# EAGLE design HONDA_BCAN (EAGLE 9.6.2)
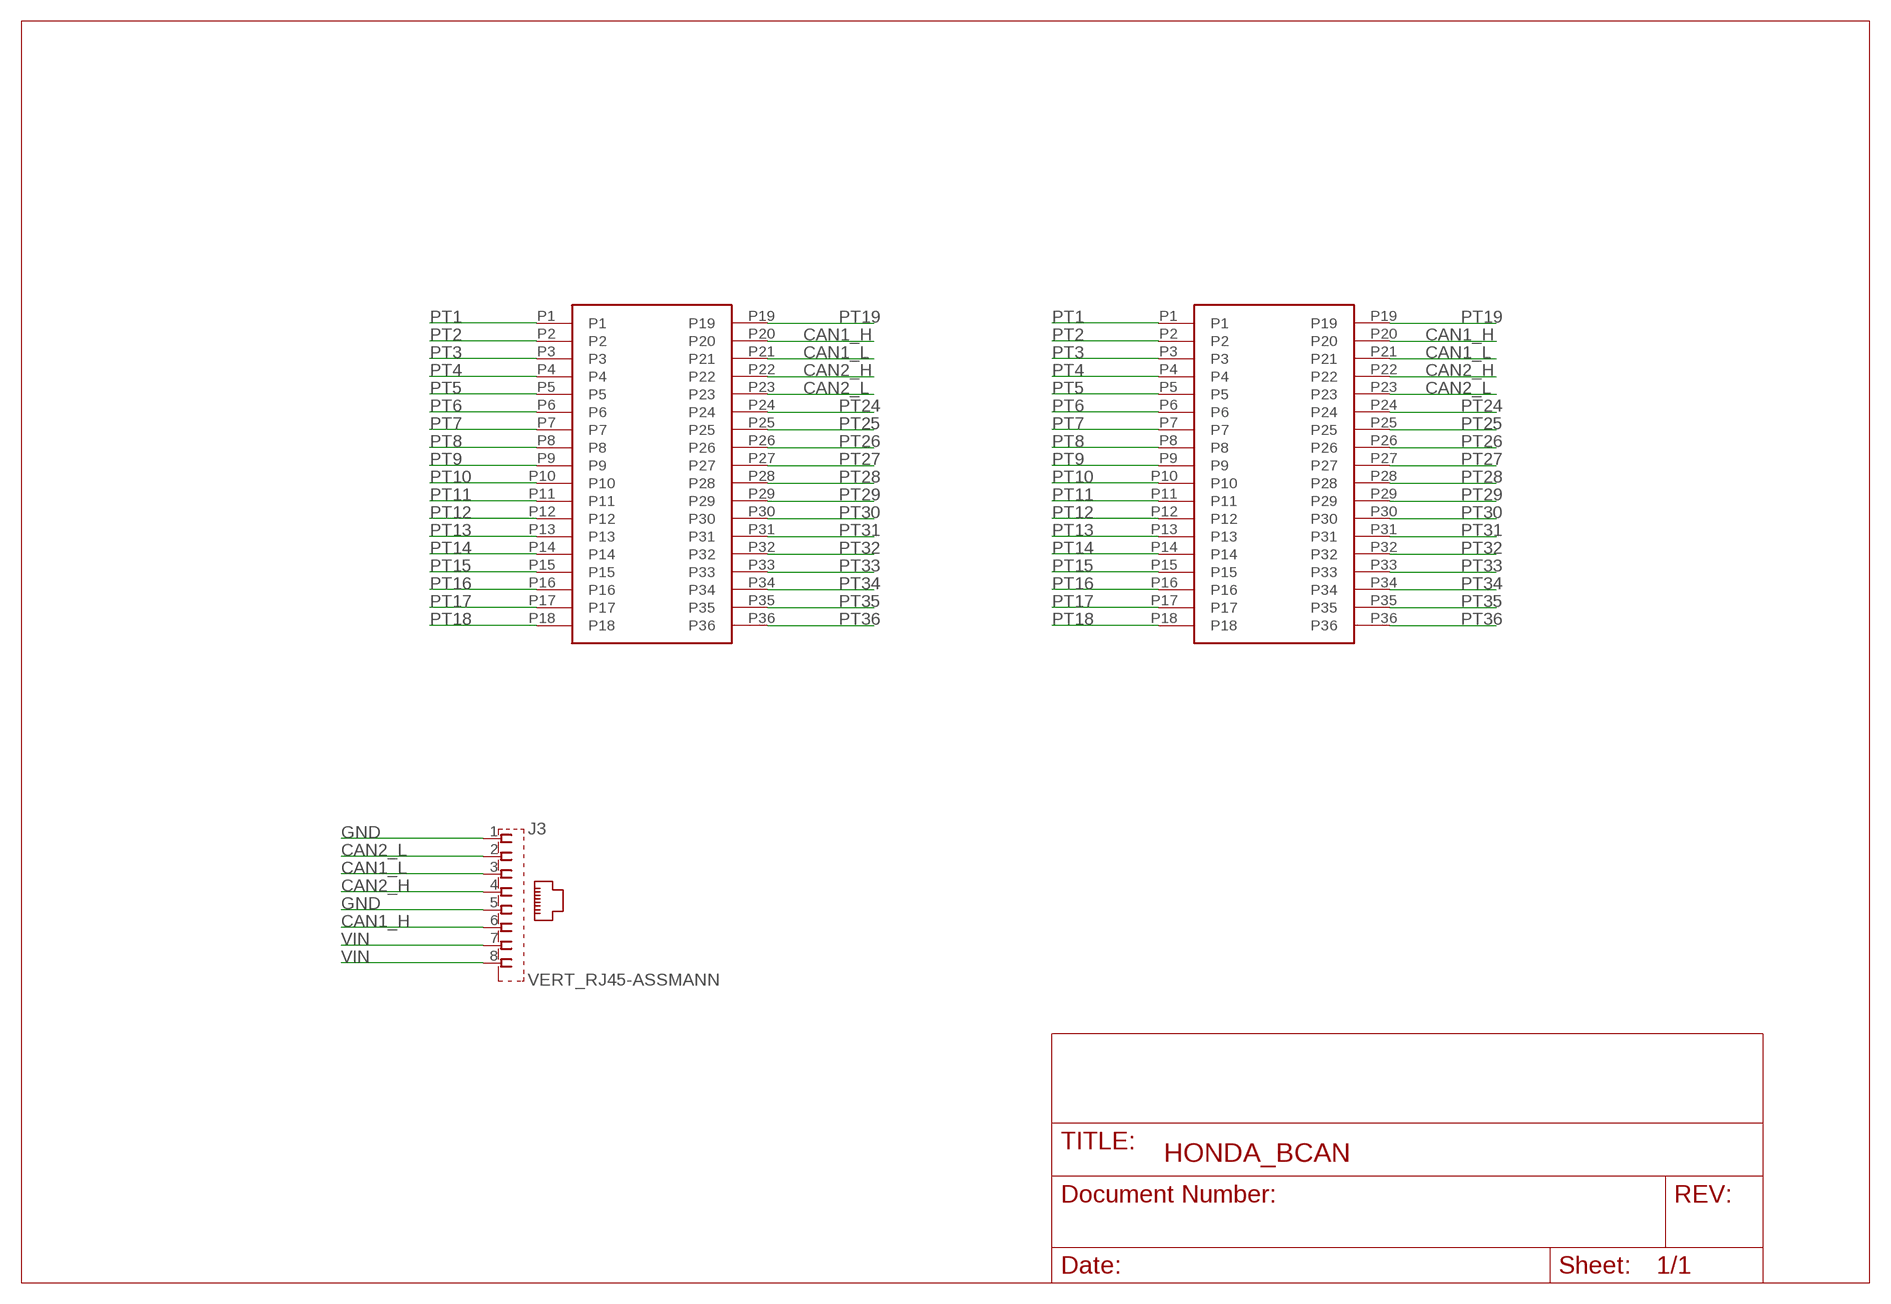
[diagram p0: schematic, sheet 1]

## Parts
J1  MX34036NF4  [MX34036NF4]
J2  MX34036NF4  [MX34036NF4]
J3  VERT_RJ45-ASSMANN  [RJ45-VERT]

## Nets
CAN1_H: J1.P20 J2.P20 J3.6
CAN1_L: J1.P21 J2.P21 J3.3
CAN2_H: J1.P22 J2.P22 J3.4
CAN2_L: J1.P23 J2.P23 J3.2
GND: J3.1 J3.5
PT1: J1.P1 J2.P1
PT2: J1.P2 J2.P2
PT3: J1.P3 J2.P3
PT4: J1.P4 J2.P4
PT5: J1.P5 J2.P5
PT6: J1.P6 J2.P6
PT7: J1.P7 J2.P7
PT8: J1.P8 J2.P8
PT9: J1.P9 J2.P9
PT10: J1.P10 J2.P10
PT11: J1.P11 J2.P11
PT12: J1.P12 J2.P12
PT13: J1.P13 J2.P13
PT14: J1.P14 J2.P14
PT15: J1.P15 J2.P15
PT16: J1.P16 J2.P16
PT17: J1.P17 J2.P17
PT18: J1.P18 J2.P18
PT19: J1.P19 J2.P19
PT24: J1.P24 J2.P24
PT25: J1.P25 J2.P25
PT26: J1.P26 J2.P26
PT27: J1.P27 J2.P27
PT28: J1.P28 J2.P28
PT29: J1.P29 J2.P29
PT30: J1.P30 J2.P30
PT31: J1.P31 J2.P31
PT32: J1.P32 J2.P32
PT33: J1.P33 J2.P33
PT34: J1.P34 J2.P34
PT35: J1.P35 J2.P35
PT36: J1.P36 J2.P36
VIN: J3.7 J3.8

## Library data of the parts
J1 J2 = comma.ai:MX34036NF4; MPN: MX34036NF4
J3 = comma.ai:VERT_RJ45: Mod. Jack, Right Angle, 8 posiotion, 8 contatcs RJ45 Source: GLX-S-88M.pdf; MPN: A-2004-2-4-LPS-N-R

## Board
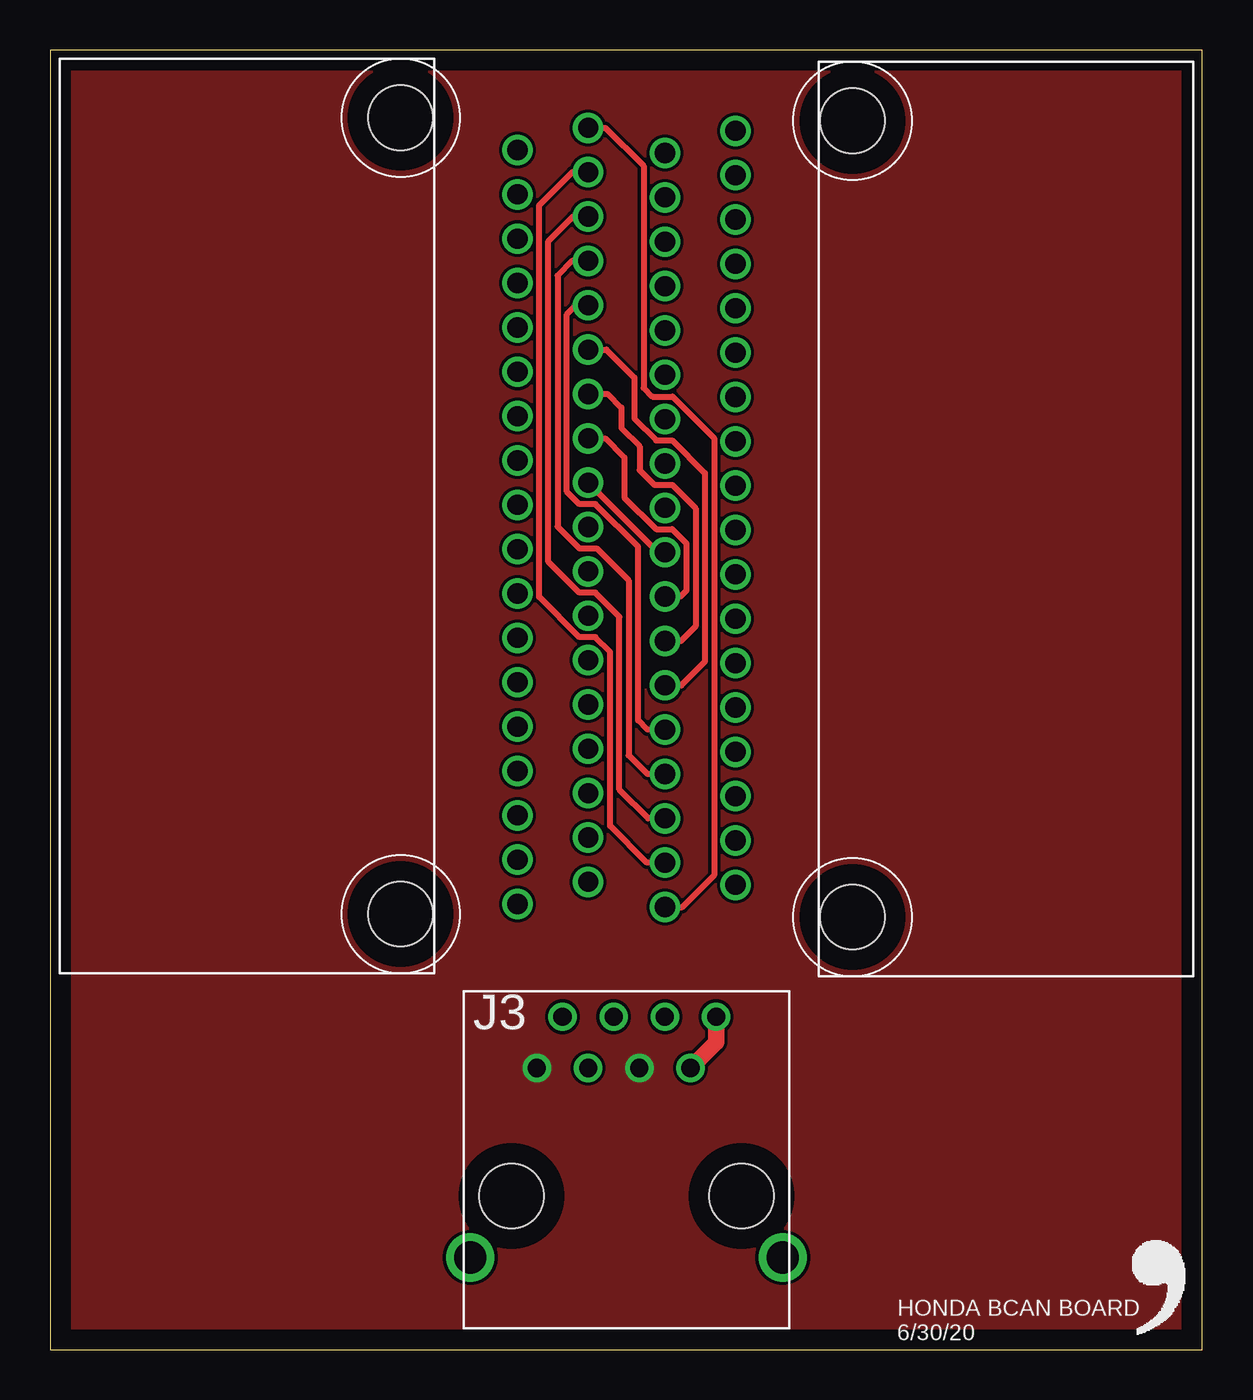
[diagram p1: board, top side]
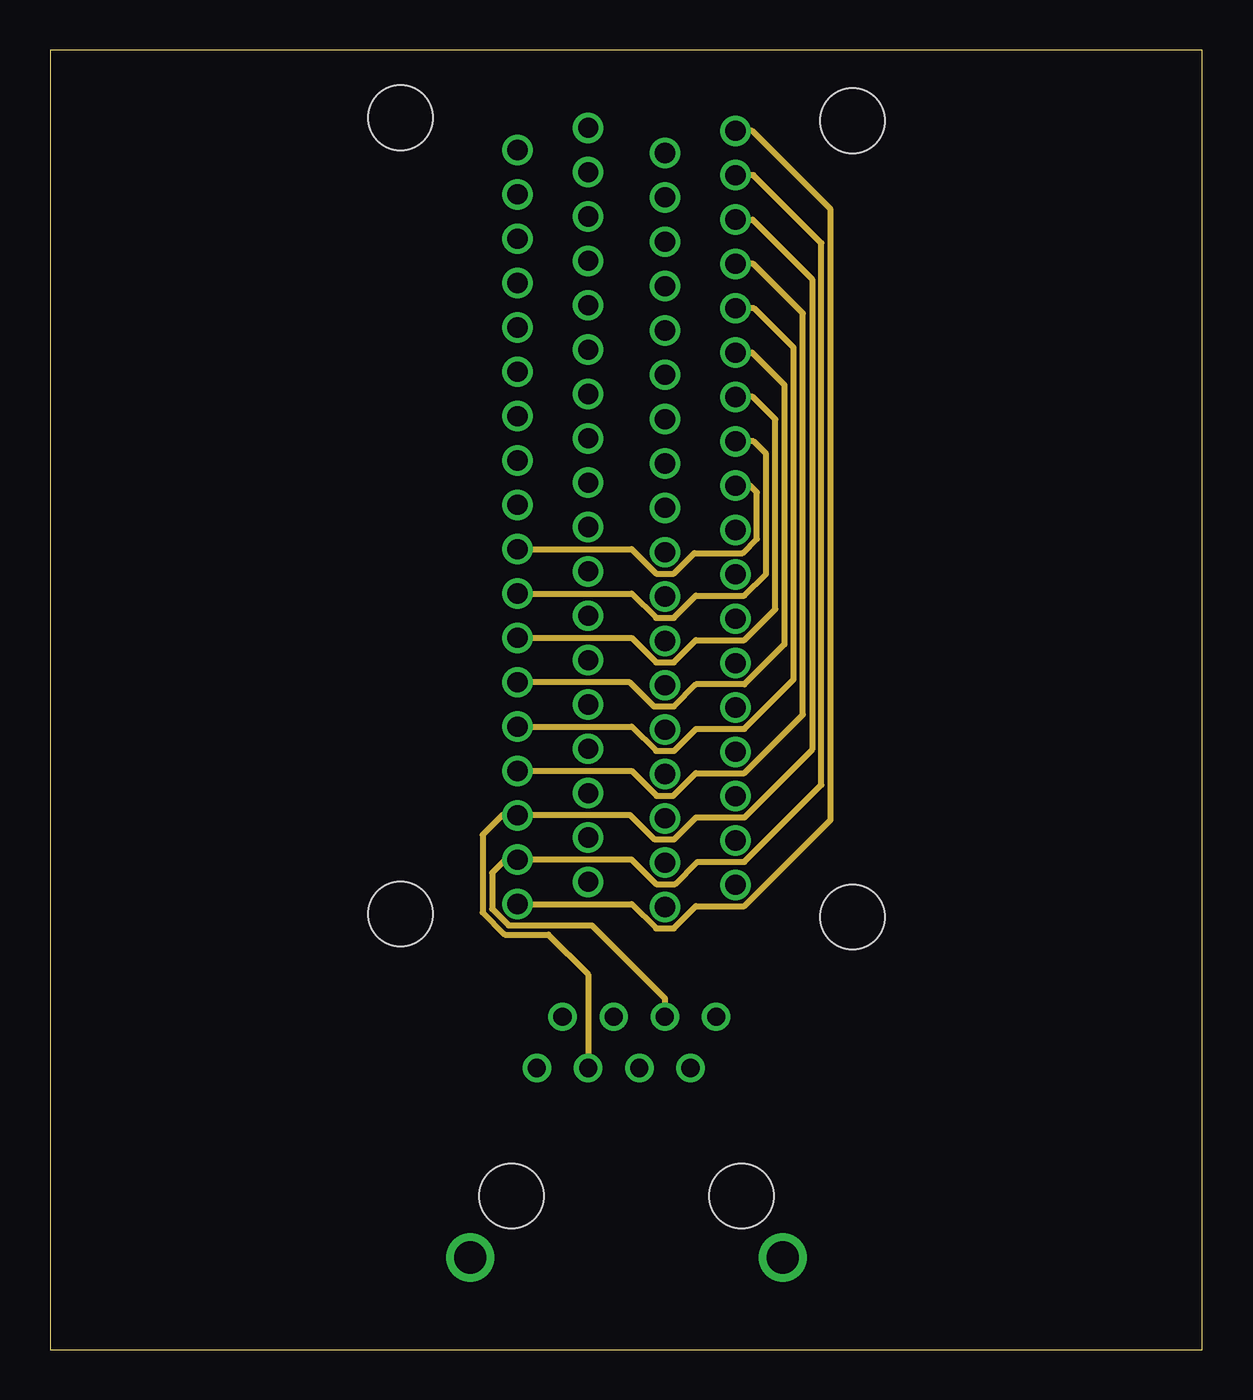
[diagram p2: board, inner layer Route2]
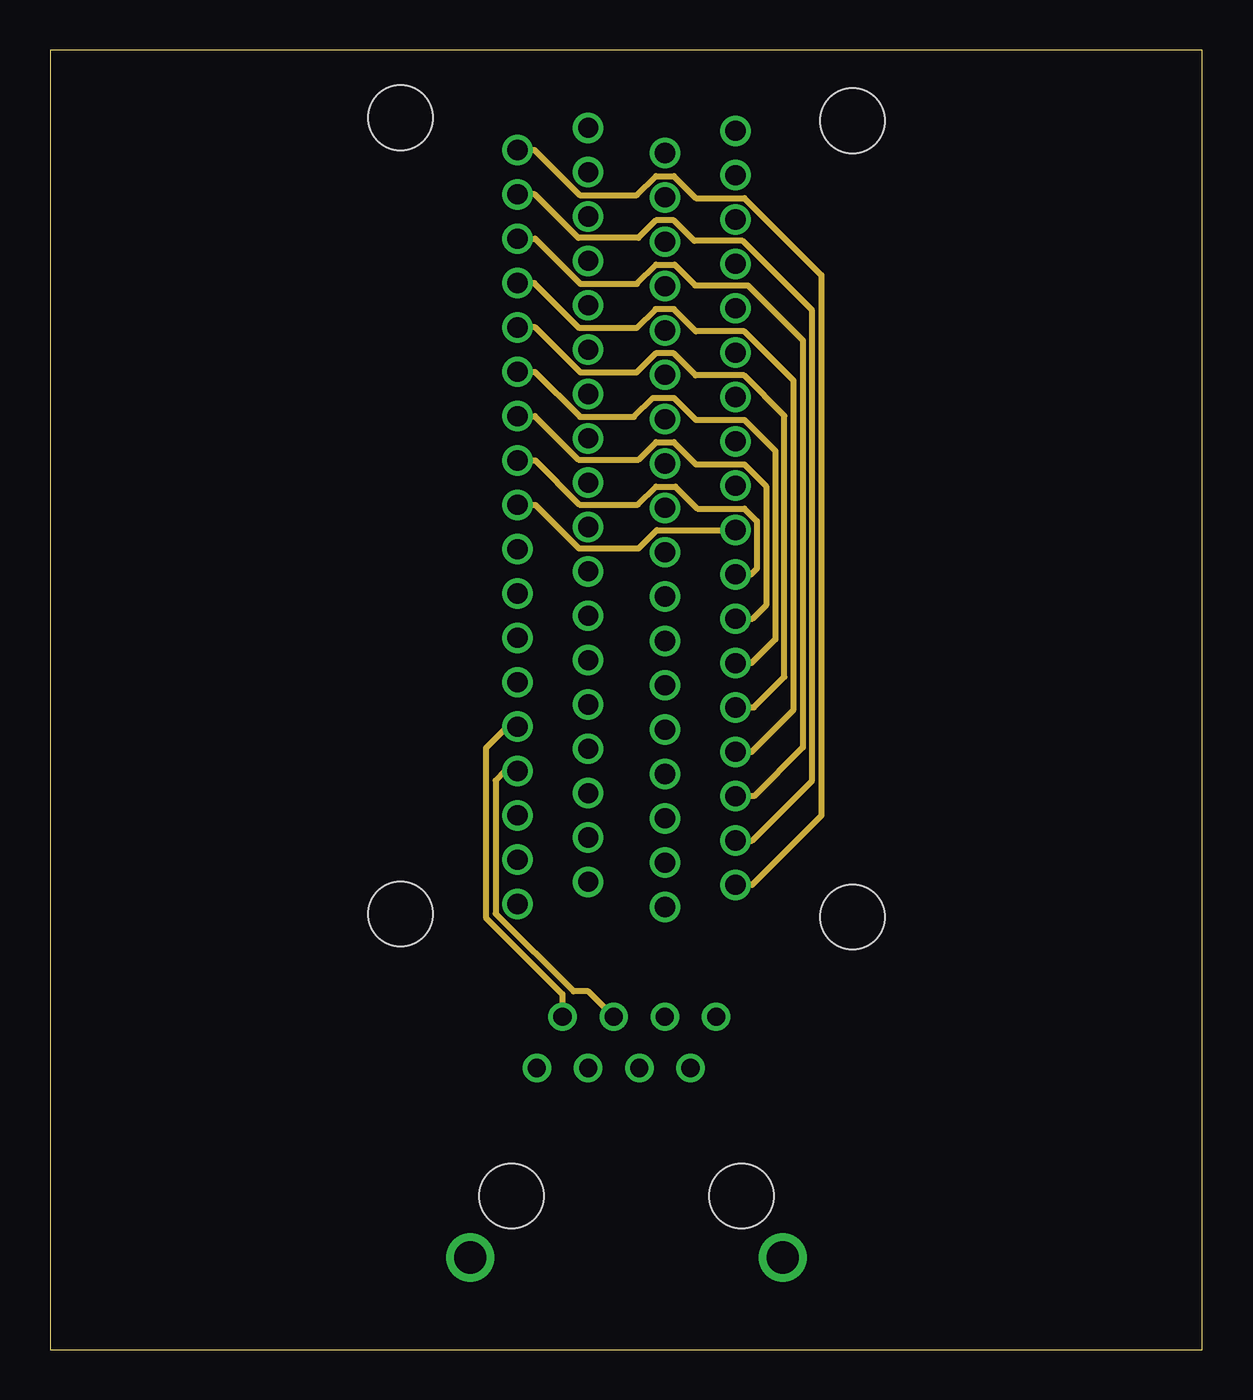
[diagram p3: board, inner layer Route15]
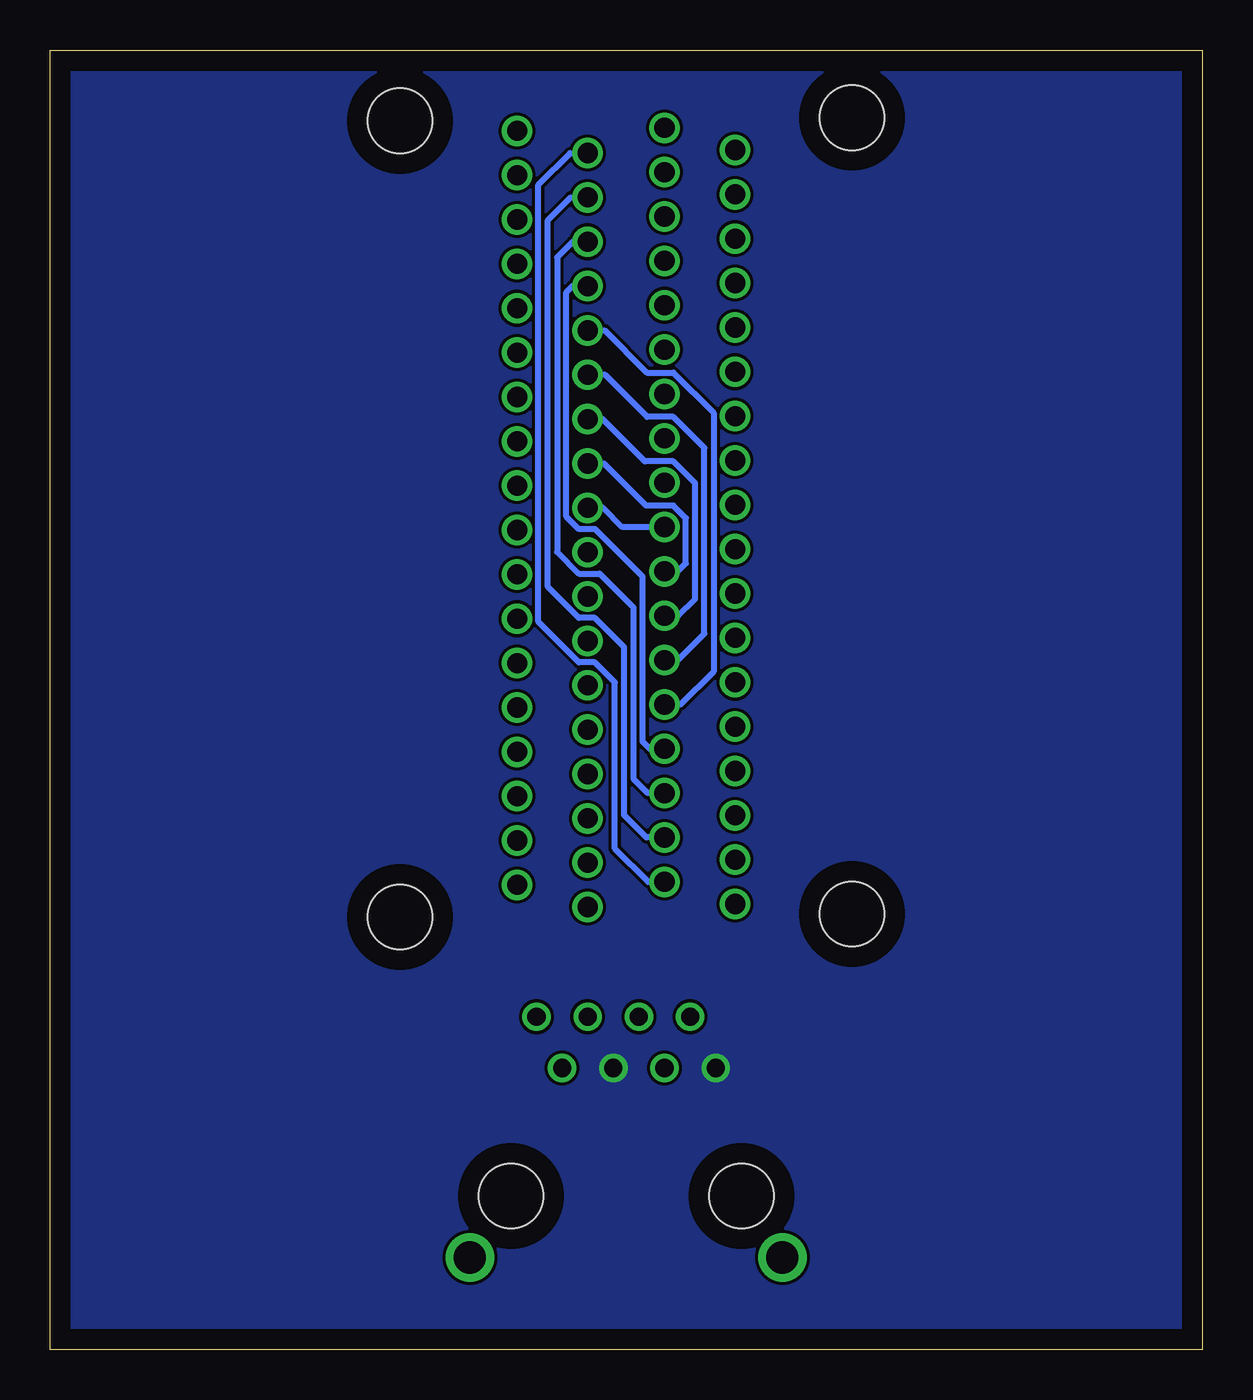
[diagram p4: board, bottom side, seen from below]

Size 57.13 x 64.44 mm. Coordinates in mm from the lower left corner, seen from the top.
Outline: 0,0 57.13,0 57.13,64.44 0,64.44 0,0
Copper layers (1+2*15+16): Top 0.035mm / dielectric 1.5mm / Route2 0.035mm / dielectric 0.15mm / Route15 0.035mm / dielectric 0.2mm / Bottom 0.035mm
Design rules "default *": minimum track width 6mil, minimum drill 0.35mm, track to track 6mil, track to pad 6mil, pad to pad 6mil, via to via 6mil, smd to smd 6mil, copper to edge 40mil, drill to drill 6mil, minimum pad ring 10mil, minimum via ring 8mil, stop-mask expansion 4mil, vias tented up to drill 0mil, thermal gap 10mil

### Footprints (pad centres in the part's own frame; a part is rotated, then mirrored left to right if it is on the bottom)
MX34036NF4 = drill 1: P1 19.98,2.54; P2 17.78,2.54; P3 15.58,2.54; P4 13.38,2.54; P5 11.18,2.54; P6 8.98,2.54; P7 6.78,2.54; P8 4.58,2.54; P9 2.38,2.54; P10 0.18,2.54; P11 -2.02,2.54; P12 -4.22,2.54; P13 -6.42,2.54; P14 -8.62,2.54; P15 -10.82,2.54; P16 -13.02,2.54; P17 -15.22,2.54; P18 -17.42,2.54; P19 21.08,-0.96; P20 18.88,-0.96; P21 16.68,-0.96; P22 14.48,-0.96; P23 12.28,-0.96; P24 10.08,-0.96; P25 7.88,-0.96; P26 5.68,-0.96; P27 3.48,-0.96; P28 1.28,-0.96; P29 -0.92,-0.96; P30 -3.12,-0.96; P31 -5.32,-0.96; P32 -7.52,-0.96; P33 -9.72,-0.96; P34 -11.92,-0.96; P35 -14.12,-0.96; P36 -16.32,-0.96 | hole 3.2: -17.92,-6.76; 21.58,-6.76
RJ45-VERT = drill 0.9: 1 -4.445,6.35; 2 -3.175,8.89; 3 -1.905,6.35; 4 -0.635,8.89; 5 0.635,6.35; 6 1.905,8.89; 7 3.175,6.35; 8 4.445,8.89 | drill 1.6: P$1 -7.75,-3.05; P$2 7.75,-3.05 | hole 3.2: -5.715,0; 5.715,0

### Placement (x,y rotation side)
J1  24.13,43.18 270 top
J2  33.02,39.37 90 top
J3  28.57,7.62 0 top
U$1  [LOGO]  53,0.44 0 top

### Tracks (layer width: path | path; a pad name or v marks a point on that pad's centre or on a via)
CAN1_H
  Route2 0.305: J2.P20 34.87,58.25 38.24,54.88 38.24,28.01 34.42,24.19 32.08,24.19 30.98,23.09 30.04,23.09 28.82,24.31 J1.P20 22.56,24.3 21.91,23.65 21.91,21.86 22.73,21.04 26.86,21.04 30.48,17.42 J3.6
CAN1_L
  Route2 0.305: J2.P21 34.83,56.05 37.78,53.1 37.78,29.75 34.42,26.39 32.02,26.39 30.92,25.29 29.98,25.29 28.76,26.51 J1.P21 22.42,26.51 21.44,25.53 21.44,21.68 22.55,20.58 24.7,20.58 26.67,18.61 J3.3
CAN2_H
  Route2 0.305: J1.P22 28.83,28.7 30.07,27.46 30.89,27.46 32.02,28.59 34.42,28.59 37.33,31.5 37.33,51.39 34.87,53.85 J2.P22
  Route15 0.305: J1.P22 22.57,28.7 22.09,28.22 22.09,21.63 25.95,17.77 26.68,17.77 J3.4
CAN2_L
  Route2 0.305: J1.P23 28.83,30.9 30.04,29.69 30.93,29.69 32.03,30.79 34.42,30.79 36.87,33.24 36.87,49.69 34.91,51.65 J2.P23
  Route15 0.305: J1.P23 22.66,30.9 21.6,29.84 21.6,21.43 25.4,17.63 J3.2
GND
  pour Top (no thermals): -1.27,66.04 -1.27,-2.54 59.69,-2.54 59.69,66.04
  pour Bottom (no thermals): -2.54,67.31 -2.54,-1.27 58.42,-1.27 58.42,67.31
PT1
  Bottom 0.305: J1.P1 27.48,23.2 29.13,24.85 29.13,33.1 30.12,34.09 30.92,34.09 32.92,36.09 32.92,57.78 31.35,59.35 J2.P1
PT2
  Bottom 0.305: J1.P2 27.57,25.4 28.67,26.5 28.67,34.84 30.12,36.29 30.92,36.29 32.45,37.83 32.45,56.02 31.32,57.15 J2.P2
PT3
  Bottom 0.305: J2.P3 31.22,54.95 32,54.17 32,39.57 30.92,38.49 29.89,38.49 28.22,36.82 28.22,28.32 27.5,27.6 J1.P3
PT4
  Bottom 0.305: J1.P4 27.4,29.8 27.76,30.16 27.76,38.33 30.12,40.69 30.92,40.69 31.54,41.31 31.54,52.45 31.24,52.75 J2.P4
PT5
  Bottom 0.305: J2.P5 29.64,50.55 27.55,48.46 26.23,48.46 24.24,46.47 24.24,33.63 25.87,32 J1.P5
PT6
  Bottom 0.305: J1.P6 26.01,34.2 24.7,35.52 24.7,44.72 26.23,46.26 27.53,46.26 29.62,48.35 J2.P6
PT7
  Bottom 0.305: J2.P7 29.74,46.15 27.65,44.06 26.23,44.06 25.15,42.98 25.15,37.23 25.98,36.4 J1.P7
PT8
  Bottom 0.305: J1.P8 26.01,38.6 25.61,39 25.61,41.24 26.23,41.86 27.58,41.86 29.67,43.95 J2.P8
PT9
  Bottom 0.305: J1.P9 28.76,40.8 29.71,41.75 J2.P9
PT10
  Top 0.305: J1.P10 30.12,39.55 J2.P10
PT11
  Top 0.305: J1.P11 27.51,45.2 28.47,44.24 28.47,42.26 30.04,40.69 30.84,40.69 31.54,39.98 31.54,37.64 31.25,37.35 J2.P11
PT12
  Top 0.305: J2.P12 31.28,35.15 32,35.87 32,41.73 30.84,42.89 29.96,42.89 29.23,43.62 29.23,44.8 28.32,45.71 28.32,46.72 27.64,47.4 J1.P12
PT13
  Top 0.305: J1.P13 27.57,49.6 28.96,48.21 28.96,46.17 30.04,45.09 30.84,45.09 32.46,43.47 32.46,34.12 31.29,32.95 J2.P13
PT14
  Top 0.305: J2.P14 29.61,30.75 29.15,31.21 29.15,39.82 27.03,41.94 26.23,41.94 25.61,42.56 25.61,51.35 26.06,51.8 J1.P14
PT15
  Top 0.305: J1.P15 25.88,54 25.15,53.27 25.15,40.82 26.23,39.74 27.09,39.74 28.68,38.15 28.68,29.48 29.61,28.55 J2.P15
PT16
  Top 0.305: J2.P16 29.65,26.35 28.23,27.77 28.23,36.34 27.03,37.54 26.23,37.54 24.7,39.08 24.7,54.98 25.92,56.2 J1.P16
PT17
  Top 0.305: J2.P17 29.58,24.15 27.76,25.97 27.76,34.61 27.03,35.34 26.23,35.34 24.24,37.33 24.24,56.75 25.89,58.4 J1.P17
PT18
  Top 0.305: J1.P18 27.53,60.6 29.42,58.71 29.42,47.7 29.85,47.27 30.86,47.27 32.91,45.21 32.91,23.53 31.34,21.95 J2.P18
PT19
  Route2 0.305: J1.P19 28.83,22.1 30.04,20.89 30.92,20.89 32.02,21.99 34.42,21.99 38.7,26.27 38.7,56.55 34.8,60.45 J2.P19
PT24
  Route2 0.305: J2.P24 34.81,49.45 36.41,47.85 36.41,34.98 34.42,32.99 32.02,32.99 30.92,31.89 29.95,31.89 28.75,33.09 J1.P24
PT25
  Route2 0.305: J1.P25 28.83,35.3 30.04,34.09 30.92,34.09 32.02,35.19 34.42,35.19 35.95,36.73 35.95,46.14 34.84,47.25 J2.P25
PT26
  Route2 0.305: J1.P26 28.83,37.5 30.04,36.29 30.92,36.29 32.02,37.39 34.42,37.39 35.5,38.47 35.5,44.43 34.88,45.05 J2.P26
PT27
  Route2 0.305: J1.P27 28.83,39.7 30.04,38.49 30.92,38.49 31.94,39.51 34.34,39.51 35.04,40.21 35.04,42.52 34.71,42.85 J2.P27
PT28
  Route15 0.305: J1.P28 24.05,41.9 26.21,39.74 29.17,39.74 30.08,40.65 J2.P28
PT29
  Route15 0.305: J1.P29 24.05,44.1 26.24,41.91 29.14,41.91 30.04,42.81 30.99,42.81 32.09,41.71 34.42,41.71 35.04,41.09 35.04,38.74 34.75,38.45 J2.P29
PT30
  Route15 0.305: J1.P30 24.03,46.3 26.19,44.14 29.17,44.14 30.04,45.01 30.92,45.01 32.02,43.91 34.42,43.91 35.5,42.83 35.5,36.92 34.83,36.25 J2.P30
PT31
  Route15 0.305: J1.P31 24.03,48.5 26.27,46.26 28.94,46.26 29.89,47.21 30.92,47.21 32.02,46.11 34.42,46.11 35.95,44.57 35.95,35.23 34.77,34.05 J2.P31
PT32
  Route15 0.305: J2.P32 34.89,31.85 36.41,33.37 36.41,46.32 34.41,48.32 32.01,48.32 30.92,49.41 30.02,49.41 29.07,48.46 26.3,48.46 24.06,50.7 J1.P32
PT33
  Route15 0.305: J2.P33 34.78,29.65 36.87,31.74 36.87,48.06 34.42,50.51 32.02,50.51 30.92,51.61 30.02,51.61 29.07,50.66 26.24,50.66 24,52.9 J1.P33
PT34
  Route15 0.305: J1.P34 24.04,55.1 26.28,52.86 29.09,52.86 30.04,53.81 30.96,53.81 31.98,52.79 34.59,52.79 37.33,50.05 37.33,29.88 34.9,27.45 J2.P34
PT35
  Route15 0.305: J2.P35 34.81,25.25 37.78,28.22 37.78,51.55 34.34,54.99 31.94,54.99 30.92,56.01 30.04,56.01 29.17,55.14 26.19,55.14 24.03,57.3 J1.P35
PT36
  Route15 0.305: J1.P36 24.01,59.5 26.25,57.26 29.09,57.26 30.04,58.21 30.92,58.21 32.02,57.11 34.42,57.11 38.24,53.29 38.24,26.48 34.81,23.05 J2.P36
VIN
  Top 0.813: J3.8 33.02,15.24 J3.7

### Text on the board
tPlace: HONDA BCAN BOARD / 6/30/20